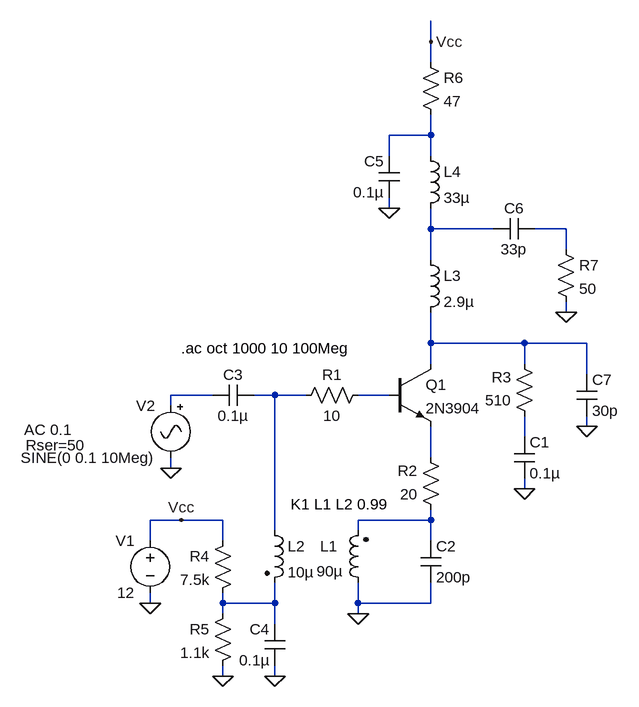
[diagram p0: schematic post-mixer-amp.asc]
post-mixer-amp.asc, the LTspice schematic file:
Version 4
SHEET 1 880 680
WIRE 384 -368 384 -400
WIRE 384 -336 384 -368
WIRE 384 -224 384 -256
WIRE 384 -224 320 -224
WIRE 320 -192 320 -224
WIRE 384 -192 384 -224
WIRE 320 -112 320 -128
WIRE 384 -80 384 -112
WIRE 480 -80 384 -80
WIRE 592 -80 544 -80
WIRE 592 -48 592 -80
WIRE 384 -32 384 -80
WIRE 592 48 592 32
WIRE 384 96 384 48
WIRE 528 96 384 96
WIRE 624 96 528 96
WIRE 384 128 384 96
WIRE 528 128 528 96
WIRE 624 144 624 96
WIRE 48 176 -16 176
WIRE 144 176 112 176
WIRE 192 176 144 176
WIRE 320 176 272 176
WIRE -16 192 -16 176
WIRE 624 224 624 208
WIRE 528 240 528 208
WIRE 384 272 384 224
WIRE -16 288 -16 272
WIRE 528 320 528 304
WIRE 0 368 -48 368
WIRE 64 368 0 368
WIRE 384 368 384 352
WIRE 384 368 272 368
WIRE 144 384 144 176
WIRE 272 384 272 368
WIRE -48 400 -48 368
WIRE 64 400 64 368
WIRE 384 400 384 368
WIRE -48 496 -48 480
WIRE 64 496 64 480
WIRE 144 496 144 464
WIRE 144 496 64 496
WIRE 272 496 272 464
WIRE 384 496 384 464
WIRE 384 496 272 496
WIRE 64 512 64 496
WIRE 272 512 272 496
WIRE 144 528 144 496
WIRE 64 608 64 592
WIRE 144 608 144 592
FLAG 64 608 0
FLAG -48 496 0
FLAG 144 608 0
FLAG 272 512 0
FLAG 528 320 0
FLAG 320 -112 0
FLAG 0 368 Vcc
FLAG 384 -368 Vcc
FLAG 592 48 0
FLAG 624 224 0
FLAG -16 288 0
SYMBOL npn 320 128 R0
SYMATTR InstName Q1
SYMATTR Value 2N3904
SYMBOL res 288 160 R90
WINDOW 0 0 56 VBottom 2
WINDOW 3 32 56 VTop 2
SYMATTR InstName R1
SYMATTR Value 10
SYMBOL res 400 368 R180
WINDOW 0 36 76 Left 2
WINDOW 3 36 40 Left 2
SYMATTR InstName R2
SYMATTR Value 20
SYMBOL res 544 224 R180
WINDOW 0 36 76 Left 2
WINDOW 3 36 40 Left 2
SYMATTR InstName R3
SYMATTR Value 510
SYMBOL cap 512 240 R0
SYMATTR InstName C1
SYMATTR Value 0.1µ
SYMBOL cap 368 400 R0
SYMATTR InstName C2
SYMATTR Value 200p
SYMBOL res 80 384 M0
SYMATTR InstName R4
SYMATTR Value 7.5k
SYMBOL res 80 496 M0
SYMATTR InstName R5
SYMATTR Value 1.1k
SYMBOL cap 112 160 R90
WINDOW 0 0 32 VBottom 2
WINDOW 3 32 32 VTop 2
SYMATTR InstName C3
SYMATTR Value 0.1µ
SYMBOL voltage -48 384 M0
WINDOW 123 0 0 Left 0
WINDOW 39 0 0 Left 0
SYMATTR InstName V1
SYMATTR Value 12
SYMBOL cap 160 528 M0
SYMATTR InstName C4
SYMATTR Value 0.1µ
SYMBOL ind2 288 480 R180
WINDOW 0 47 72 Left 2
WINDOW 3 39 33 Left 2
SYMATTR InstName L1
SYMATTR Value 90µ
SYMATTR Type ind
SYMBOL ind2 128 368 R0
SYMATTR InstName L2
SYMATTR Value 10µ
SYMATTR Type ind
SYMBOL ind 368 -48 R0
SYMATTR InstName L3
SYMATTR Value 2.9µ
SYMBOL ind 368 -208 R0
SYMATTR InstName L4
SYMATTR Value 33µ
SYMBOL res 368 -352 R0
SYMATTR InstName R6
SYMATTR Value 47
SYMBOL cap 336 -192 M0
SYMATTR InstName C5
SYMATTR Value 0.1µ
SYMBOL cap 544 -96 R90
WINDOW 0 0 32 VBottom 2
WINDOW 3 32 32 VTop 2
SYMATTR InstName C6
SYMATTR Value 33p
SYMBOL res 576 -64 R0
SYMATTR InstName R7
SYMATTR Value 50
SYMBOL cap 608 144 R0
SYMATTR InstName C7
SYMATTR Value 30p
SYMBOL Misc\\signal -16 176 M0
WINDOW 123 152 53 Left 2
WINDOW 39 131 77 Left 2
SYMATTR InstName V2
SYMATTR Value SINE(0 0.1 10Meg)
SYMATTR Value2 AC 0.1
SYMATTR SpiceLine Rser=50
TEXT 168 344 Left 2 !K1 L1 L2 0.99
TEXT 0 104 Left 2 !.ac oct 1000 10 100Meg

The netlist it stands for:
* post-mixer-amp.asc
Q1 N004 N007 N009 0 2N3904
R1 N007 N006 10
R2 N010 N009 20
R3 N008 N004 510
C1 N008 0 0.1µ
C2 N010 0 200p
R4 Vcc N011 7.5k
R5 N011 0 1.1k
C3 N006 N005 0.1µ
V1 Vcc 0 12
C4 N011 0 0.1µ
L1 0 N010 90µ
L2 N006 N011 10µ
L3 N002 N004 2.9µ
L4 N001 N002 33µ
R6 Vcc N001 47
C5 N001 0 0.1µ
C6 N003 N002 33p
R7 N003 0 50
C7 N004 0 30p
V2 N005 0 SINE(0 0.1 10Meg) AC 0.1 Rser=50
.model NPN NPN
.model PNP PNP
.lib standard.bjt
K1 L1 L2 0.99
.ac oct 1000 10 100Meg
.backanno
.end